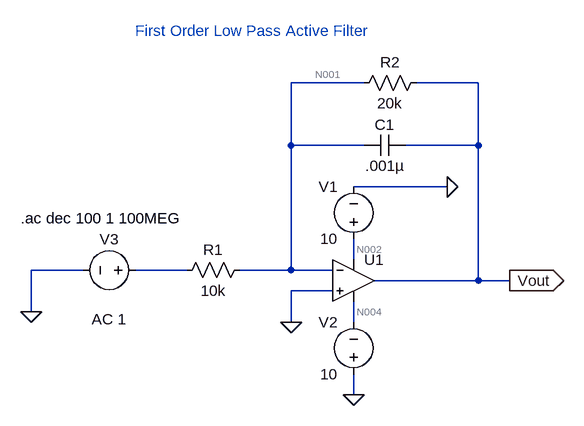
[diagram p0: schematic First Order Low pass Active Filter.asc]
First Order Low pass Active Filter.asc, the LTspice schematic file:
Version 4
SHEET 1 880 680
WIRE 256 -128 144 -128
WIRE 432 -128 336 -128
WIRE 144 -32 144 -128
WIRE 256 -32 144 -32
WIRE 432 -32 432 -128
WIRE 432 -32 320 -32
WIRE 384 32 240 32
WIRE 240 144 240 112
WIRE -176 160 -256 160
WIRE -16 160 -96 160
WIRE 144 160 144 -32
WIRE 144 160 64 160
WIRE 208 160 144 160
WIRE 432 176 432 -32
WIRE 432 176 272 176
WIRE 480 176 432 176
WIRE 208 192 144 192
WIRE -256 224 -256 160
WIRE 144 240 144 192
WIRE 240 240 240 208
WIRE 240 352 240 320
FLAG 384 32 0
FLAG 240 352 0
FLAG -256 224 0
FLAG 144 240 0
FLAG 480 176 Vout
IOPIN 480 176 Out
SYMBOL Opamps\\UniversalOpamp2 240 176 R0
SYMATTR InstName U1
SYMBOL voltage 240 128 R180
WINDOW 0 24 96 Left 2
WINDOW 3 24 16 Left 2
WINDOW 123 0 0 Left 0
WINDOW 39 0 0 Left 0
SYMATTR InstName V1
SYMATTR Value 10
SYMBOL voltage 240 336 R180
WINDOW 0 24 96 Left 2
WINDOW 3 24 16 Left 2
WINDOW 123 0 0 Left 0
WINDOW 39 0 0 Left 0
SYMATTR InstName V2
SYMATTR Value 10
SYMBOL res 80 144 R90
WINDOW 0 0 56 VBottom 2
WINDOW 3 32 56 VTop 2
SYMATTR InstName R1
SYMATTR Value 10k
SYMBOL cap 320 -48 R90
WINDOW 0 0 32 VBottom 2
WINDOW 3 32 32 VTop 2
SYMATTR InstName C1
SYMATTR Value .001µ
SYMBOL res 352 -144 R90
WINDOW 0 0 56 VBottom 2
WINDOW 3 32 56 VTop 2
SYMATTR InstName R2
SYMATTR Value 20k
SYMBOL voltage -80 160 R90
WINDOW 0 -32 56 VBottom 2
WINDOW 3 32 56 VTop 2
WINDOW 123 60 56 VTop 2
WINDOW 39 0 0 Left 0
SYMATTR InstName V3
SYMATTR Value ""
SYMATTR Value2 AC 1
TEXT -272 80 Left 2 !.ac dec 100 1 100MEG
TEXT -96 -208 Left 2 ;First Order Low Pass Active Filter

The netlist it stands for:
* First Order Low pass Active Filter.asc
XU1 0 N001 N002 N004 Vout level.2 Avol=1Meg GBW=10Meg Slew=10Meg ilimit=25m rail=0 Vos=0 phimargin=45 en=0 enk=0 in=0 ink=0 Rin=500Meg  ; pins IN+ IN- V+ V- OUT
V1 N002 0 10
V2 0 N004 10
R1 N001 N003 10k
C1 Vout N001 .001µ
R2 Vout N001 20k
V3 N003 0 AC 1
.ac dec 100 1 100MEG
* First Order Low Pass Active Filter
.lib UniversalOpamps2.sub
.backanno
.end

* Results of the author's LTspice run, read from the files saved beside the schematic
* Operating Point, zero values left out:
*   V(n002) = 10 V
*   V(n004) = -10 V
*   I(V2) = -999.5 µA
*   I(V1) = -999.5 µA
*   Ix(u1:3) = 999.5 µA
*   Ix(u1:4) = -999.5 µA
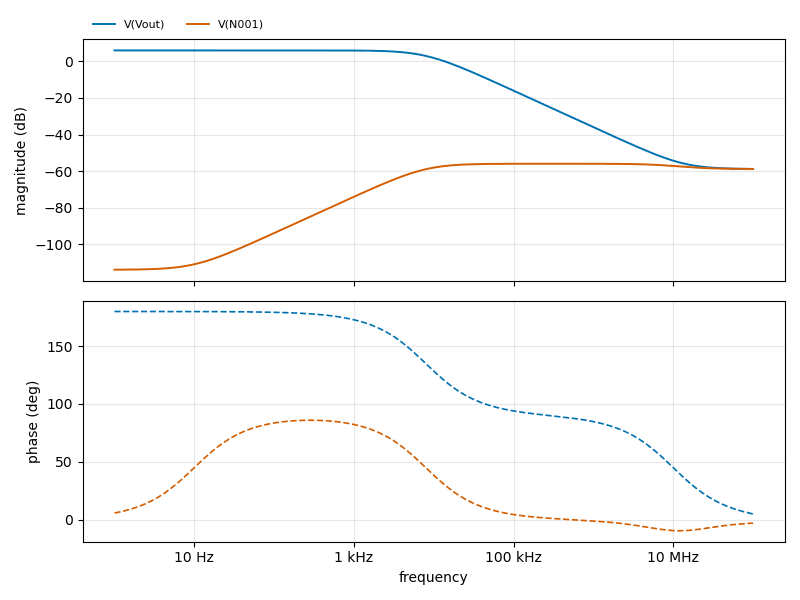
[diagram p1: AC Analysis of First Order Low pass Active Filter.asc, plotted from the saved traces]
* AC Analysis, 1 run:
*   V(Vout): 6.02 dB at 1 Hz, -58.81 dB at 100 MHz, peak 6.02 dB at 1 Hz, 3 dB below the peak at 7.945 kHz
*   V(N001): -113.91 dB at 1 Hz, -58.83 dB at 100 MHz, peak -55.96 dB at 338.8 kHz, 3 dB below the peak at 7.936 kHz